# EAGLE design LB_BIT_w7_FORK-v03(rev1) (EAGLE 6.6.0)
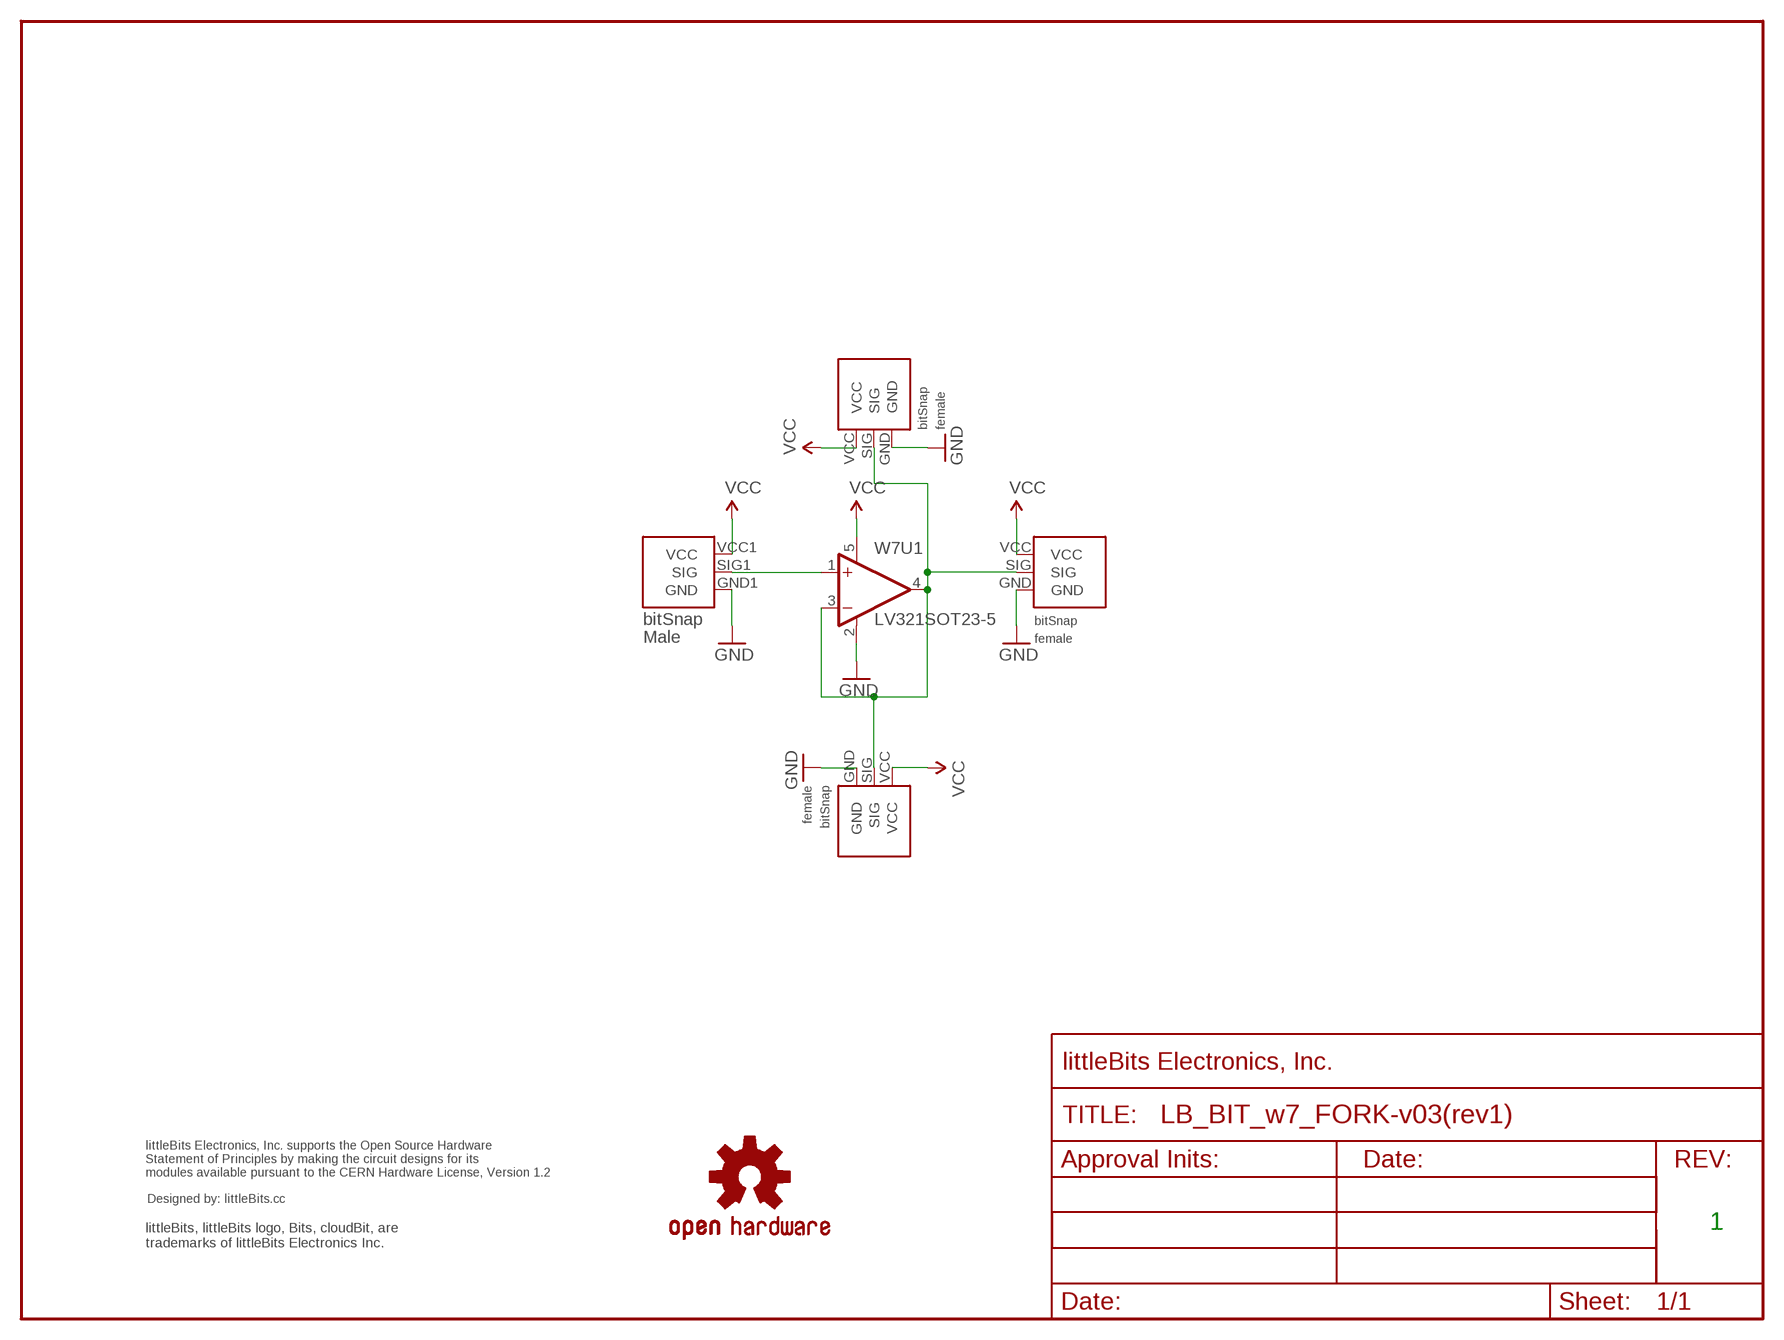
[diagram p0: schematic, sheet 1]

## Parts
FRAME1  FRAME-LETTER-OHWOHW  [FABDWG01-OHW]
U$2  OSHW-LOGOL  [OSHW-LOGO-L]
U$12  OSHWCREDIT  [OSHWCREDIT]
W7BSF1  BITSNAP_V03_FEMALE  [BITSNAP_V03_FEMALE]
W7BSF2  BITSNAP_V03_FEMALE  [BITSNAP_V03_FEMALE]
W7BSF3  BITSNAP_V03_FEMALE  [BITSNAP_V03_FEMALE]
W7BSM1  BITSNAP_V03_MALE  [BITSNAP_V03_MALE]
W7U1  LV321SOT23-5  [SOT23-5]

## Nets
GND: W7BSF1.GND W7BSF2.GND W7BSF3.GND W7BSM1.GND1(GND) W7U1.2(V-)
N$1: W7BSM1.SIG1(SIG) W7U1.1(+IN)
N$2: W7BSF1.SIG W7BSF2.SIG W7BSF3.SIG W7U1.3(-IN) W7U1.4(OUT)
VCC: W7BSF1.VCC W7BSF2.VCC W7BSF3.VCC W7BSM1.VCC1(VCC) W7U1.5(V+)

## Notes on the sheet
- 1

## Library data of the parts
FRAME1 = LITTLEBITS:FRAME-LETTER-OHW
U$2 = LITTLEBITS:OSHW-LOGO: Open Source Hardware Logo This logo indicates the piece of hardware it is found on incorporates a OSHW license and/or adheres to the definition of open source hardware found here: http://freedomdefined.org/OSHW
U$12 = LITTLEBITS:OSHWCREDIT
W7BSF1-W7BSF3 = bitSnap:BITSNAP_V03_FEMALE
W7BSM1 = bitSnap:BITSNAP_V03_MALE
W7U1 = LITTLEBITS:LV321

## Board
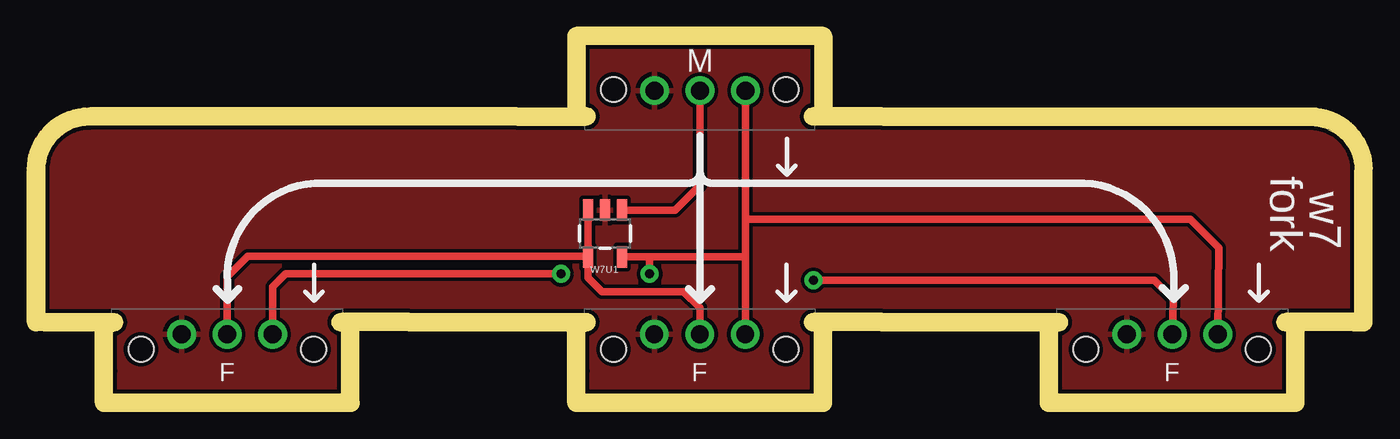
[diagram p1: board, top side]
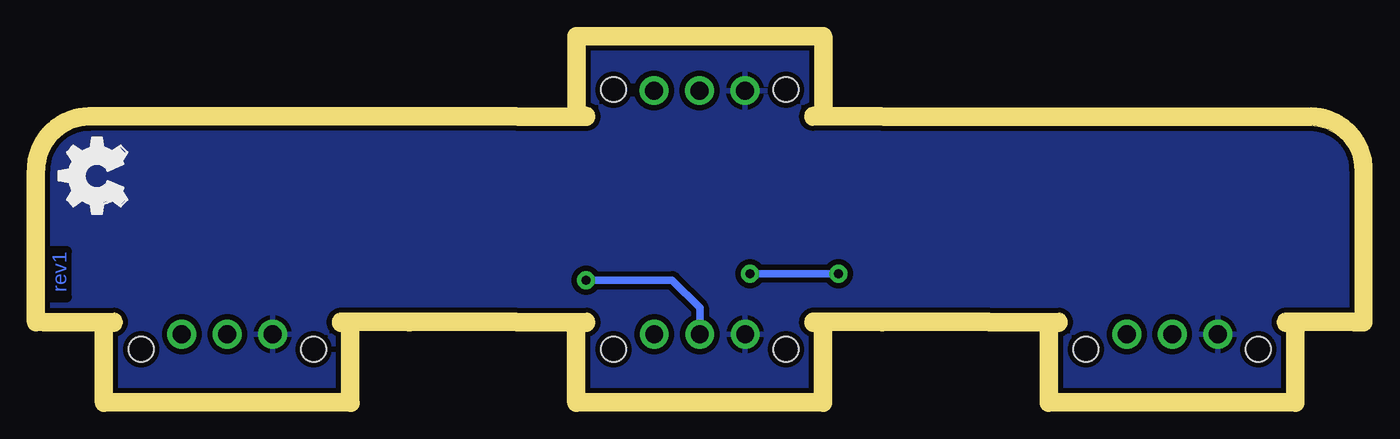
[diagram p2: board, bottom side, seen from below]

Size 73.2 x 19.5 mm. Coordinates in mm from the lower left corner, seen from the top.
Outline: 0,4.5 0,12.5 arc-90 2.5,15 26.4,15
Outline: 73.2,4.5 73.2,12.5 arc90 70.7,15 46.8,15
Outline: 20.4,4.5 26.4,4.5
Outline: 46.8,4.5 52.85,4.5
Copper layers (1*16): Top 0.035mm / dielectric 1.5mm / Bottom 0.035mm
Design rules "default": minimum track width 8mil, minimum drill 20mil, track to track 8mil, track to pad 8mil, pad to pad 8mil, via to via 8mil, smd to smd 8mil, copper to edge 10mil, drill to drill 8mil, minimum pad ring 12mil, minimum via ring 10mil, stop-mask expansion 4mil, vias tented up to drill 25mil, thermal gap 10mil
Milling: 11 lines

### Footprints (pad centres in the part's own frame; a part is rotated, then mirrored left to right if it is on the bottom)
BITSNAP_V03_FEMALE = drill 1: GND 3.91,3.33; SIG 6.45,3.33; VCC 8.99,3.33 | hole 1.4: 1.63,2.5; 11.27,2.5
BITSNAP_V03_MALE = drill 1: GND1 8.98,2.56; SIG1 6.44,2.56; VCC1 3.9,2.56 | hole 1.4: 11.27,2.5; 1.63,2.5
SOT23-5 = smd 0.55 x 1.2: 1 -0.95,-1.3; 2 0,-1.3; 3 0.95,-1.3; 4 0.95,1.3; 5 -0.95,1.3

### Placement (x,y rotation side)
FRAME1  28.44,-5.85 0 top  (outside the outline)
U$2  -4.45,-75.9 0 top  (outside the outline)
U$8  [OSHW_FILLX150_NOTEXT]  68.6,9.22 0 top
U$12  -63.75,-71.75 0 top  (outside the outline)
W7BSF1  3.75,0 0 top
W7BSF2  30.15,0 0 top
W7BSF3  56.55,0 0 top
W7BSM1  43.05,19.5 180 top
W7U1  31.3,8.96 180 top

### Tracks (layer width: path | path; a pad name or v marks a point on that pad's centre or on a via)
GND
  pour Bottom (isolate 0.305): 0.17,19.33 73.07,19.33 73.07,0.17 0.17,0.17
  pour Top: 0.17,19.33 73.07,19.33 73.07,0.17 0.17,0.17
N$1
  Top 0.406: W7U1.1 35.21,10.26 36.6,11.65 36.6,17.03 W7BSM1.SIG1
N$2  (via drill 0.5)
  Top 0.406: W7U1.3 W7U1.4 | W7U1.4 30.36,6.5 31.15,5.7 35.7,5.7 36.6,4.8 W7BSF2.SIG | W7BSF1.SIG 10.2,6.55 11.35,7.7 30.31,7.7 W7U1.4 | W7BSF3.SIG 63.05,5.3 62,6.35 v42.95,6.35
  Bottom 0.406: v42.95,6.35 38.15,6.35 36.6,4.8 W7BSF2.SIG
VCC  (via drill 0.5)
  Top 0.406: W7BSM1.VCC1 39.15,9.7 | 39.15,9.7 39.15,7.65 | 39.15,7.65 39.15,3.24 W7BSF2.VCC | W7U1.5 33.7,7.66 | 33.7,7.66 39.14,7.66 39.15,7.65 | W7BSF1.VCC 12.74,5.99 13.45,6.7 v28.85,6.7 | v33.8,6.7 33.8,7.56 33.7,7.66 | W7BSF3.VCC 65.59,8.16 64,9.75 39.2,9.75 39.15,9.7
  Bottom 0.406: v28.85,6.7 v33.8,6.7

### Text on the board
Bottom: rev1
tPlace: fork | w7
Milling: 1mm DIA. ROUTER PATH
Measures: C.L.